# Altium schematic sheet mcu.SchDoc
size A4; SheetNumber: 2; SheetTotal: 3
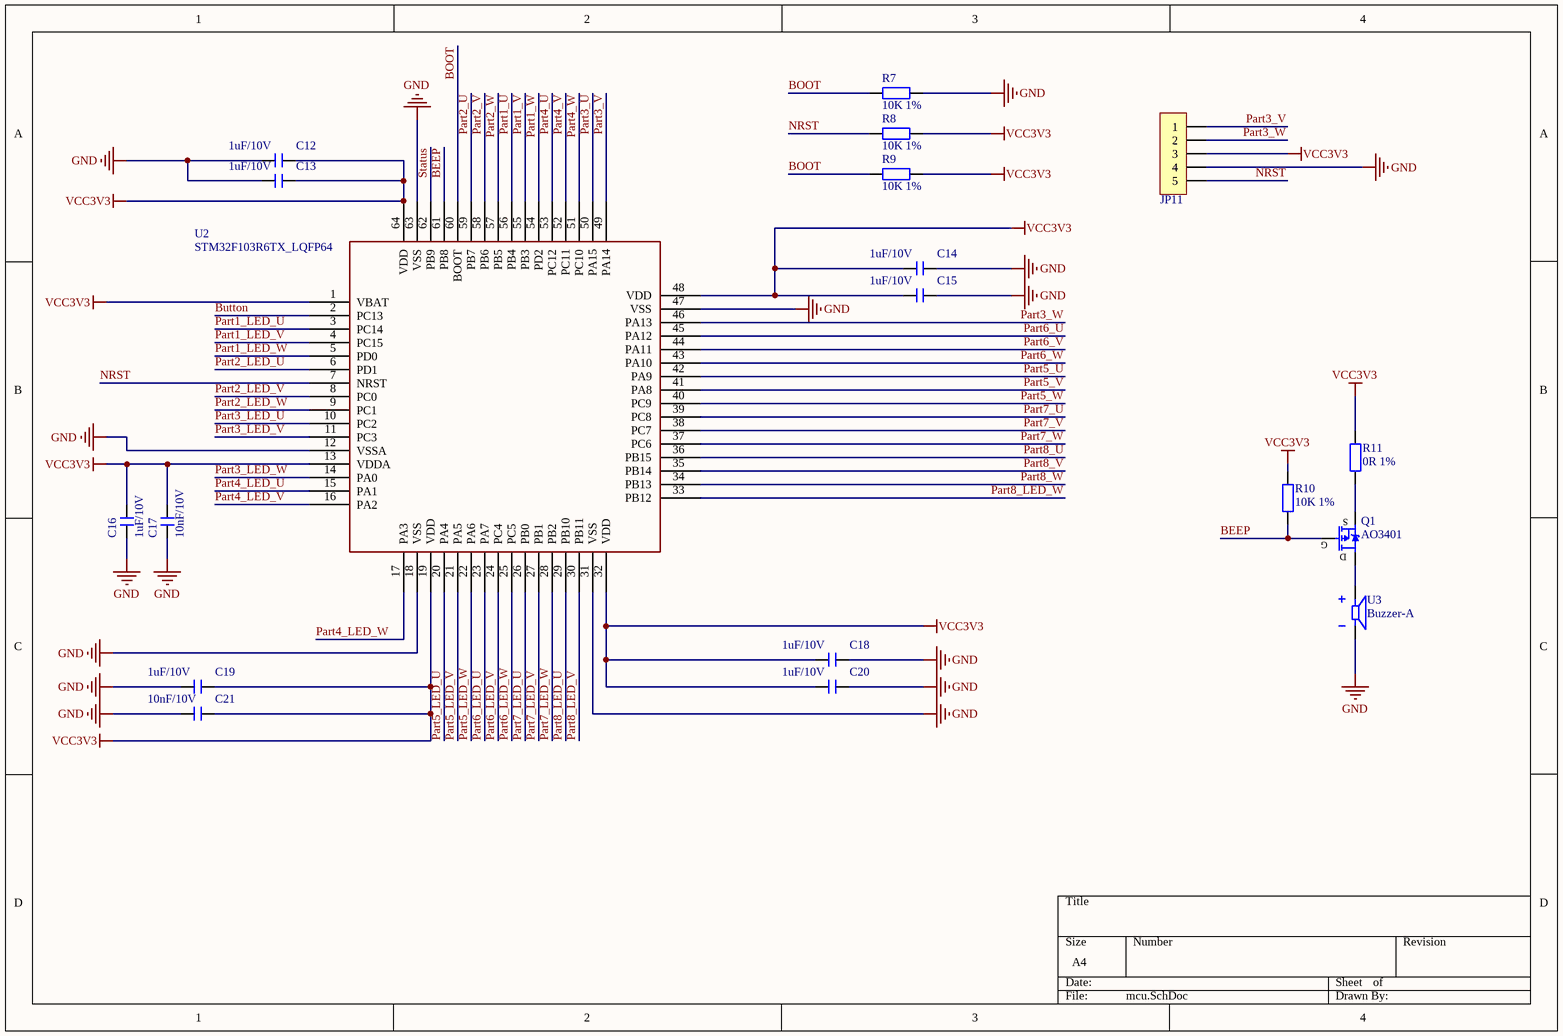
[diagram p0: mcu.SchDoc]

## Parts
C12  1uF/10V  [C0603_L]
C13  1uF/10V  [C0603_L]
C14  1uF/10V  [C0603_L]
C15  1uF/10V  [C0603_L]
C16  1uF/10V  [C0603_L]
C17  10nF/10V  [C0603_L]
C18  1uF/10V  [C0603_L]
C19  1uF/10V  [C0603_L]
C20  1uF/10V  [C0603_L]
C21  10nF/10V  [C0603_L]
JP11  HDR-1X5  [HDR2.54-LI-5P]  (value not drawn)
Q1  AO3401  [SOT23-3L]
R7  10K 1%  [R0603_L]
R8  10K 1%  [R0603_L]
R9  10K 1%  [R0603_L]
R10  10K 1%  [R0603_L]
R11  0R 1%  [R0603_L]
U2  STM32F103R6TX_LQFP64  [LQFP64 10x10_N]
U3  Buzzer-A  [BEEP 5x9x5.5]

## Nets
GND: C12.2 C13.2 C14.1 C15.1 C16.1 C17.1 C18.1 C19.2 C20.1 C21.2 JP11.4 R7.2 U2.12(VSSA) U2.18(VSS) U2.31(VSS) U2.47(VSS) U2.63(VSS) U3.2
VCC3V3: C12.1 C13.1 C14.2 C15.2 C16.2 C17.2 C18.2 C19.1 C20.2 C21.1 JP11.3 R8.2 R9.2 R10.2 R11.2 U2.1(VBAT) U2.13(VDDA) U2.19(VDD) U2.32(VDD) U2.48(VDD) U2.64(VDD)
BEEP: Q1.1(G) R10.1 U2.61(PB8)
BOOT: R7.1 R9.1 U2.60(BOOT)
Button: U2.2(PC13)
NRST: JP11.5 R8.1 U2.7(NRST)
Part1_LED_U: U2.3(PC14)
Part1_LED_V: U2.4(PC15)
Part1_LED_W: U2.5(PD0)
Part1_U: U2.56(PB4)
Part1_V: U2.55(PB3)
Part1_W: U2.54(PD2)
Part2_LED_U: U2.6(PD1)
Part2_LED_V: U2.8(PC0)
Part2_LED_W: U2.9(PC1)
Part2_U: U2.59(PB7)
Part2_V: U2.58(PB6)
Part2_W: U2.57(PB5)
Part3_LED_U: U2.10(PC2)
Part3_LED_V: U2.11(PC3)
Part3_LED_W: U2.14(PA0)
Part3_U: U2.50(PA15)
Part3_V: JP11.1 U2.49(PA14)
Part3_W: JP11.2 U2.46(PA13)
Part4_LED_U: U2.15(PA1)
Part4_LED_V: U2.16(PA2)
Part4_LED_W: U2.17(PA3)
Part4_U: U2.53(PC12)
Part4_V: U2.52(PC11)
Part4_W: U2.51(PC10)
Part5_LED_U: U2.20(PA4)
Part5_LED_V: U2.21(PA5)
Part5_LED_W: U2.22(PA6)
Part5_U: U2.42(PA9)
Part5_V: U2.41(PA8)
Part5_W: U2.40(PC9)
Part6_LED_U: U2.23(PA7)
Part6_LED_V: U2.24(PC4)
Part6_LED_W: U2.25(PC5)
Part6_U: U2.45(PA12)
Part6_V: U2.44(PA11)
Part6_W: U2.43(PA10)
Part7_LED_U: U2.26(PB0)
Part7_LED_V: U2.27(PB1)
Part7_LED_W: U2.28(PB2)
Part7_U: U2.39(PC8)
Part7_V: U2.38(PC7)
Part7_W: U2.37(PC6)
Part8_LED_U: U2.29(PB10)
Part8_LED_V: U2.30(PB11)
Part8_LED_W: U2.33(PB12)
Part8_U: U2.36(PB15)
Part8_V: U2.35(PB14)
Part8_W: U2.34(PB13)
Status: U2.62(PB9)
NetQ1_2: Q1.2(S) R11.1
NetQ1_3: Q1.3(D) U3.1

## Library data of the parts
C12-C21 = C: 无极性贴片电容; 版权归属: 源创客; 材质: X7R; BOM名称: 无极性贴片电容; 学习资源: www.ooocke.com
JP11 = Header 5: 5P接插件; 版权归属: 源创客; BOM名称: 5P接插件; 学习资源: www.ooocke.com
Q1 = AO3401: P沟道 30V/4.2A; BOM名称: 场效应管; 版权归属: 源创客; 学习资源: www.ooocke.com; 描述: P沟道 30V/4.2A
R7-R11 = R: 贴片电阻; 版权归属: 源创客; BOM名称: 贴片电阻; 学习资源: www.ooocke.com
U3 = Buzzer-A: 有源蜂鸣器